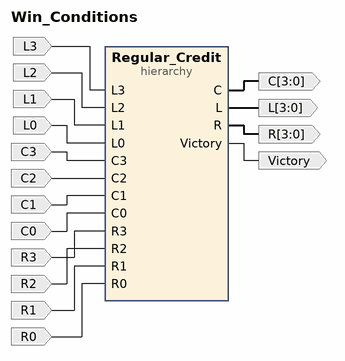
[diagram p0: block diagram of the top level]
# Vivado block design Win_Conditions, xc7a35tcpg236-1, Vivado 2018.3
create_bd_design Win_Conditions

create_bd_port -dir I L3
create_bd_port -dir I L2
create_bd_port -dir I L1
create_bd_port -dir I L0
create_bd_port -dir I C3
create_bd_port -dir I C2
create_bd_port -dir I C1
create_bd_port -dir I C0
create_bd_port -dir I R3
create_bd_port -dir I R2
create_bd_port -dir I R1
create_bd_port -dir I R0
create_bd_port -dir O Victory
create_bd_port -dir O -from 3 -to 0 L
create_bd_port -dir O -from 3 -to 0 C
create_bd_port -dir O -from 3 -to 0 R

create_bd_cell -type hier Regular_Credit

# ---- hierarchy /Regular_Credit ----
current_bd_instance /Regular_Credit
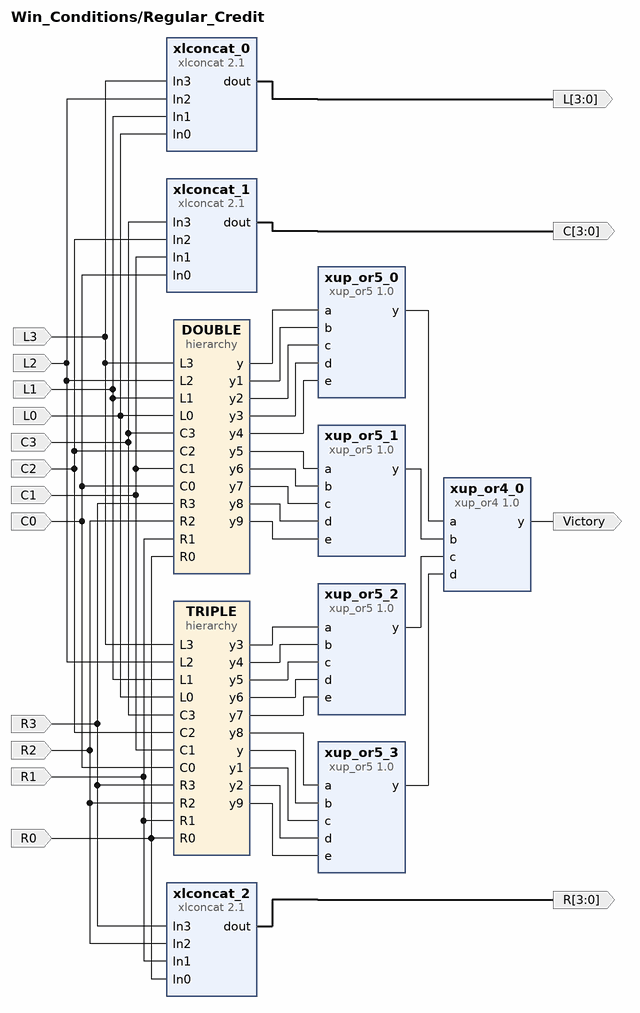
[diagram p1: block diagram inside /Regular_Credit]
create_bd_pin -dir O Victory
create_bd_pin -dir I L3
create_bd_pin -dir I L2
create_bd_pin -dir I L1
create_bd_pin -dir I L0
create_bd_pin -dir I C3
create_bd_pin -dir I C2
create_bd_pin -dir I C1
create_bd_pin -dir I C0
create_bd_pin -dir I R3
create_bd_pin -dir I R2
create_bd_pin -dir I R1
create_bd_pin -dir I R0
create_bd_pin -dir O -from 3 -to 0 L
create_bd_pin -dir O -from 3 -to 0 C
create_bd_pin -dir O -from 3 -to 0 R

create_bd_cell -type ip -vlnv xilinx.com:xup:xup_or5:1.0 xup_or5_0
set_property -dict {CONFIG.DELAY 0} [get_bd_cells xup_or5_0]
create_bd_cell -type ip -vlnv xilinx.com:xup:xup_or5:1.0 xup_or5_1
set_property -dict {CONFIG.DELAY 0} [get_bd_cells xup_or5_1]
create_bd_cell -type ip -vlnv xilinx.com:xup:xup_or5:1.0 xup_or5_2
set_property -dict {CONFIG.DELAY 0} [get_bd_cells xup_or5_2]
create_bd_cell -type ip -vlnv xilinx.com:xup:xup_or5:1.0 xup_or5_3
set_property -dict {CONFIG.DELAY 0} [get_bd_cells xup_or5_3]
create_bd_cell -type ip -vlnv xilinx.com:xup:xup_or4:1.0 xup_or4_0
set_property -dict {CONFIG.DELAY 0} [get_bd_cells xup_or4_0]
create_bd_cell -type ip -vlnv xilinx.com:ip:xlconcat:2.1 xlconcat_0
set_property -dict {CONFIG.NUM_PORTS 4} [get_bd_cells xlconcat_0]
create_bd_cell -type ip -vlnv xilinx.com:ip:xlconcat:2.1 xlconcat_1
set_property -dict {CONFIG.NUM_PORTS 4} [get_bd_cells xlconcat_1]
create_bd_cell -type ip -vlnv xilinx.com:ip:xlconcat:2.1 xlconcat_2
set_property -dict {CONFIG.NUM_PORTS 4} [get_bd_cells xlconcat_2]
create_bd_cell -type hier DOUBLE
create_bd_cell -type hier TRIPLE

# ---- hierarchy /Regular_Credit/DOUBLE ----
current_bd_instance /Regular_Credit/DOUBLE
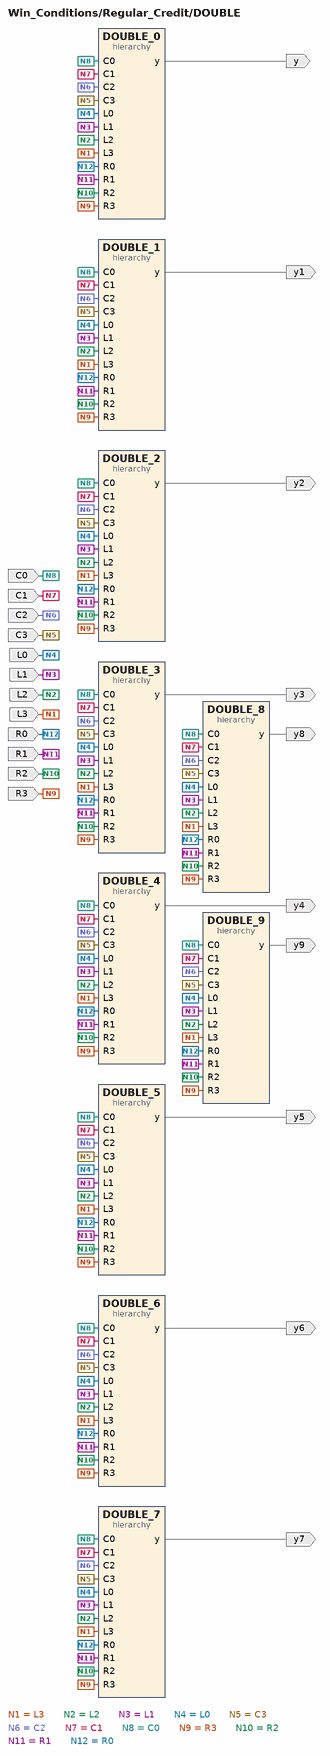
[diagram p2: block diagram inside /Regular_Credit/DOUBLE]
create_bd_pin -dir I L3
create_bd_pin -dir I L2
create_bd_pin -dir I L1
create_bd_pin -dir I L0
create_bd_pin -dir I C3
create_bd_pin -dir I C2
create_bd_pin -dir I C1
create_bd_pin -dir I C0
create_bd_pin -dir I R3
create_bd_pin -dir I R2
create_bd_pin -dir I R1
create_bd_pin -dir I R0
create_bd_pin -dir O y
create_bd_pin -dir O y1
create_bd_pin -dir O y2
create_bd_pin -dir O y3
create_bd_pin -dir O y4
create_bd_pin -dir O y5
create_bd_pin -dir O y6
create_bd_pin -dir O y7
create_bd_pin -dir O y8
create_bd_pin -dir O y9

create_bd_cell -type hier DOUBLE_0
create_bd_cell -type hier DOUBLE_1
create_bd_cell -type hier DOUBLE_2
create_bd_cell -type hier DOUBLE_3
create_bd_cell -type hier DOUBLE_4
create_bd_cell -type hier DOUBLE_5
create_bd_cell -type hier DOUBLE_6
create_bd_cell -type hier DOUBLE_7
create_bd_cell -type hier DOUBLE_8
create_bd_cell -type hier DOUBLE_9

# ---- hierarchy /Regular_Credit/DOUBLE/DOUBLE_0 ----
current_bd_instance /Regular_Credit/DOUBLE/DOUBLE_0
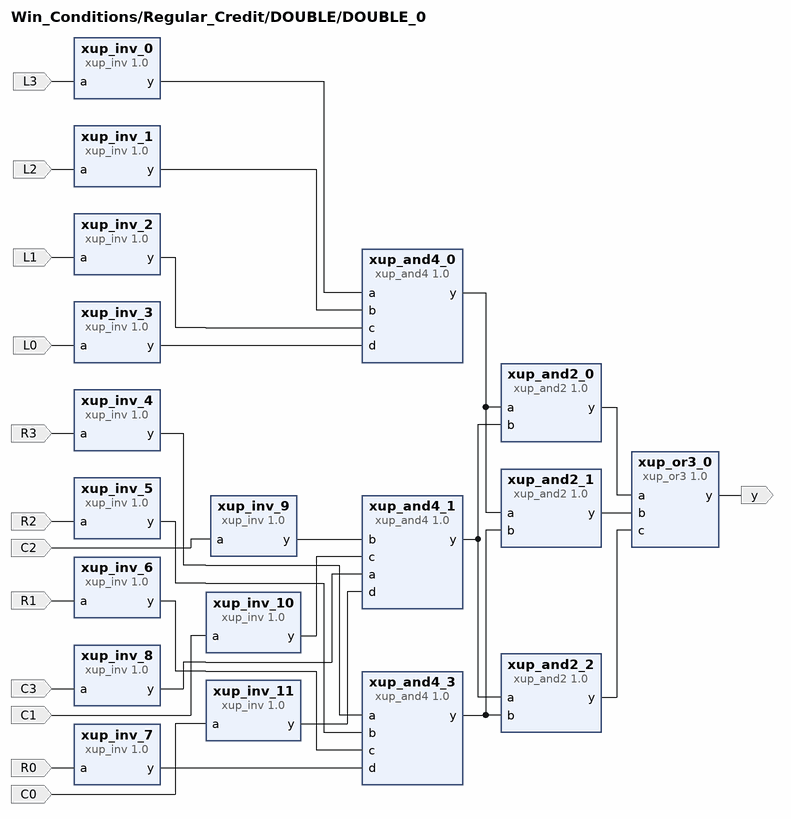
[diagram p3: block diagram inside /Regular_Credit/DOUBLE/DOUBLE_0]
create_bd_pin -dir I L3
create_bd_pin -dir I L2
create_bd_pin -dir I L1
create_bd_pin -dir I L0
create_bd_pin -dir I C3
create_bd_pin -dir I C2
create_bd_pin -dir I C1
create_bd_pin -dir I C0
create_bd_pin -dir I R3
create_bd_pin -dir I R2
create_bd_pin -dir I R1
create_bd_pin -dir I R0
create_bd_pin -dir O y

create_bd_cell -type ip -vlnv xilinx.com:xup:xup_and4:1.0 xup_and4_0
set_property -dict {CONFIG.DELAY 0} [get_bd_cells xup_and4_0]
create_bd_cell -type ip -vlnv xilinx.com:xup:xup_or3:1.0 xup_or3_0
set_property -dict {CONFIG.DELAY 0} [get_bd_cells xup_or3_0]
create_bd_cell -type ip -vlnv xilinx.com:xup:xup_and4:1.0 xup_and4_1
set_property -dict {CONFIG.DELAY 0} [get_bd_cells xup_and4_1]
create_bd_cell -type ip -vlnv xilinx.com:xup:xup_and4:1.0 xup_and4_3
set_property -dict {CONFIG.DELAY 0} [get_bd_cells xup_and4_3]
create_bd_cell -type ip -vlnv xilinx.com:xup:xup_and2:1.0 xup_and2_0
set_property -dict {CONFIG.DELAY 0} [get_bd_cells xup_and2_0]
create_bd_cell -type ip -vlnv xilinx.com:xup:xup_and2:1.0 xup_and2_1
set_property -dict {CONFIG.DELAY 0} [get_bd_cells xup_and2_1]
create_bd_cell -type ip -vlnv xilinx.com:xup:xup_and2:1.0 xup_and2_2
set_property -dict {CONFIG.DELAY 0} [get_bd_cells xup_and2_2]
create_bd_cell -type ip -vlnv xilinx.com:xup:xup_inv:1.0 xup_inv_0
set_property -dict {CONFIG.DELAY 0} [get_bd_cells xup_inv_0]
create_bd_cell -type ip -vlnv xilinx.com:xup:xup_inv:1.0 xup_inv_5
set_property -dict {CONFIG.DELAY 0} [get_bd_cells xup_inv_5]
create_bd_cell -type ip -vlnv xilinx.com:xup:xup_inv:1.0 xup_inv_3
set_property -dict {CONFIG.DELAY 0} [get_bd_cells xup_inv_3]
create_bd_cell -type ip -vlnv xilinx.com:xup:xup_inv:1.0 xup_inv_7
set_property -dict {CONFIG.DELAY 0} [get_bd_cells xup_inv_7]
create_bd_cell -type ip -vlnv xilinx.com:xup:xup_inv:1.0 xup_inv_4
set_property -dict {CONFIG.DELAY 0} [get_bd_cells xup_inv_4]
create_bd_cell -type ip -vlnv xilinx.com:xup:xup_inv:1.0 xup_inv_6
set_property -dict {CONFIG.DELAY 0} [get_bd_cells xup_inv_6]
create_bd_cell -type ip -vlnv xilinx.com:xup:xup_inv:1.0 xup_inv_1
set_property -dict {CONFIG.DELAY 0} [get_bd_cells xup_inv_1]
create_bd_cell -type ip -vlnv xilinx.com:xup:xup_inv:1.0 xup_inv_2
set_property -dict {CONFIG.DELAY 0} [get_bd_cells xup_inv_2]
create_bd_cell -type ip -vlnv xilinx.com:xup:xup_inv:1.0 xup_inv_8
set_property -dict {CONFIG.DELAY 0} [get_bd_cells xup_inv_8]
create_bd_cell -type ip -vlnv xilinx.com:xup:xup_inv:1.0 xup_inv_10
set_property -dict {CONFIG.DELAY 0} [get_bd_cells xup_inv_10]
create_bd_cell -type ip -vlnv xilinx.com:xup:xup_inv:1.0 xup_inv_9
set_property -dict {CONFIG.DELAY 0} [get_bd_cells xup_inv_9]
create_bd_cell -type ip -vlnv xilinx.com:xup:xup_inv:1.0 xup_inv_11
set_property -dict {CONFIG.DELAY 0} [get_bd_cells xup_inv_11]

# ---- hierarchy /Regular_Credit/DOUBLE/DOUBLE_1 ----
current_bd_instance /Regular_Credit/DOUBLE/DOUBLE_1
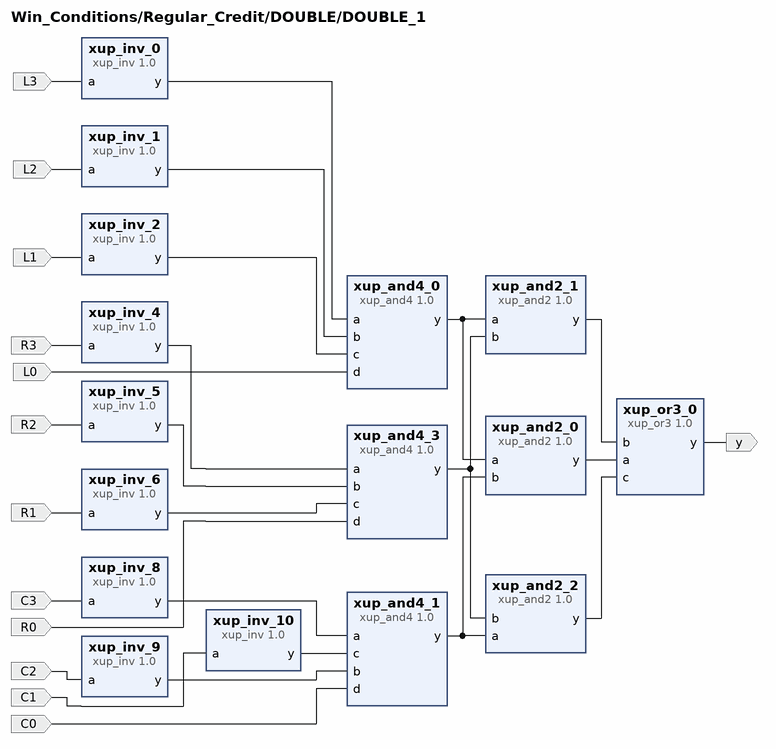
[diagram p4: block diagram inside /Regular_Credit/DOUBLE/DOUBLE_1]
create_bd_pin -dir I L3
create_bd_pin -dir I L2
create_bd_pin -dir I L1
create_bd_pin -dir I L0
create_bd_pin -dir I C3
create_bd_pin -dir I C2
create_bd_pin -dir I C1
create_bd_pin -dir I C0
create_bd_pin -dir I R3
create_bd_pin -dir I R2
create_bd_pin -dir I R1
create_bd_pin -dir I R0
create_bd_pin -dir O y

create_bd_cell -type ip -vlnv xilinx.com:xup:xup_and4:1.0 xup_and4_0
set_property -dict {CONFIG.DELAY 0} [get_bd_cells xup_and4_0]
create_bd_cell -type ip -vlnv xilinx.com:xup:xup_or3:1.0 xup_or3_0
set_property -dict {CONFIG.DELAY 0} [get_bd_cells xup_or3_0]
create_bd_cell -type ip -vlnv xilinx.com:xup:xup_and4:1.0 xup_and4_1
set_property -dict {CONFIG.DELAY 0} [get_bd_cells xup_and4_1]
create_bd_cell -type ip -vlnv xilinx.com:xup:xup_and4:1.0 xup_and4_3
set_property -dict {CONFIG.DELAY 0} [get_bd_cells xup_and4_3]
create_bd_cell -type ip -vlnv xilinx.com:xup:xup_and2:1.0 xup_and2_0
set_property -dict {CONFIG.DELAY 0} [get_bd_cells xup_and2_0]
create_bd_cell -type ip -vlnv xilinx.com:xup:xup_and2:1.0 xup_and2_1
set_property -dict {CONFIG.DELAY 0} [get_bd_cells xup_and2_1]
create_bd_cell -type ip -vlnv xilinx.com:xup:xup_and2:1.0 xup_and2_2
set_property -dict {CONFIG.DELAY 0} [get_bd_cells xup_and2_2]
create_bd_cell -type ip -vlnv xilinx.com:xup:xup_inv:1.0 xup_inv_0
set_property -dict {CONFIG.DELAY 0} [get_bd_cells xup_inv_0]
create_bd_cell -type ip -vlnv xilinx.com:xup:xup_inv:1.0 xup_inv_5
set_property -dict {CONFIG.DELAY 0} [get_bd_cells xup_inv_5]
create_bd_cell -type ip -vlnv xilinx.com:xup:xup_inv:1.0 xup_inv_4
set_property -dict {CONFIG.DELAY 0} [get_bd_cells xup_inv_4]
create_bd_cell -type ip -vlnv xilinx.com:xup:xup_inv:1.0 xup_inv_6
set_property -dict {CONFIG.DELAY 0} [get_bd_cells xup_inv_6]
create_bd_cell -type ip -vlnv xilinx.com:xup:xup_inv:1.0 xup_inv_1
set_property -dict {CONFIG.DELAY 0} [get_bd_cells xup_inv_1]
create_bd_cell -type ip -vlnv xilinx.com:xup:xup_inv:1.0 xup_inv_2
set_property -dict {CONFIG.DELAY 0} [get_bd_cells xup_inv_2]
create_bd_cell -type ip -vlnv xilinx.com:xup:xup_inv:1.0 xup_inv_8
set_property -dict {CONFIG.DELAY 0} [get_bd_cells xup_inv_8]
create_bd_cell -type ip -vlnv xilinx.com:xup:xup_inv:1.0 xup_inv_10
set_property -dict {CONFIG.DELAY 0} [get_bd_cells xup_inv_10]
create_bd_cell -type ip -vlnv xilinx.com:xup:xup_inv:1.0 xup_inv_9
set_property -dict {CONFIG.DELAY 0} [get_bd_cells xup_inv_9]

# ---- hierarchy /Regular_Credit/DOUBLE/DOUBLE_2 ----
current_bd_instance /Regular_Credit/DOUBLE/DOUBLE_2
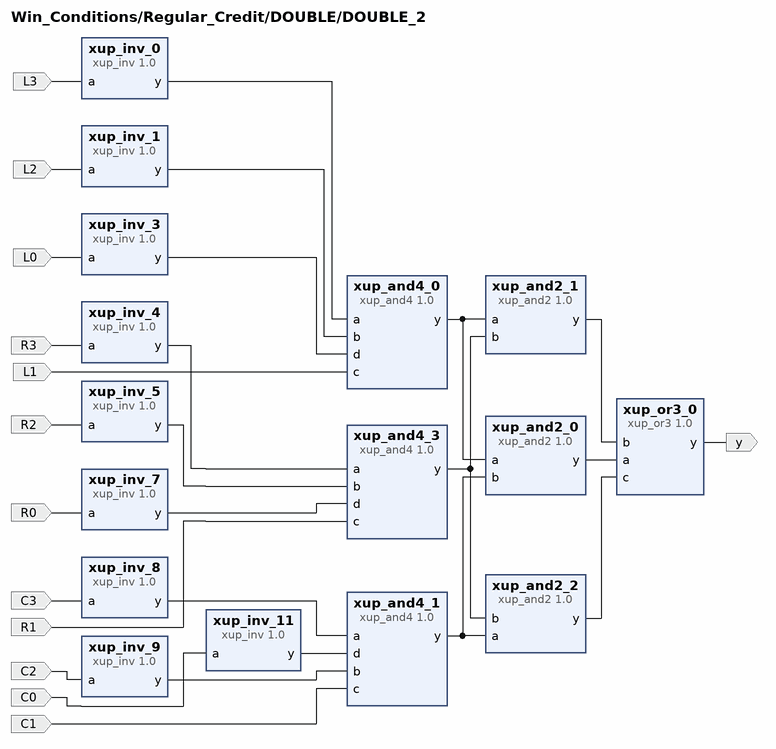
[diagram p5: block diagram inside /Regular_Credit/DOUBLE/DOUBLE_2]
create_bd_pin -dir I L3
create_bd_pin -dir I L2
create_bd_pin -dir I L1
create_bd_pin -dir I L0
create_bd_pin -dir I C3
create_bd_pin -dir I C2
create_bd_pin -dir I C1
create_bd_pin -dir I C0
create_bd_pin -dir I R3
create_bd_pin -dir I R2
create_bd_pin -dir I R1
create_bd_pin -dir I R0
create_bd_pin -dir O y

create_bd_cell -type ip -vlnv xilinx.com:xup:xup_and4:1.0 xup_and4_0
set_property -dict {CONFIG.DELAY 0} [get_bd_cells xup_and4_0]
create_bd_cell -type ip -vlnv xilinx.com:xup:xup_or3:1.0 xup_or3_0
set_property -dict {CONFIG.DELAY 0} [get_bd_cells xup_or3_0]
create_bd_cell -type ip -vlnv xilinx.com:xup:xup_and4:1.0 xup_and4_1
set_property -dict {CONFIG.DELAY 0} [get_bd_cells xup_and4_1]
create_bd_cell -type ip -vlnv xilinx.com:xup:xup_and4:1.0 xup_and4_3
set_property -dict {CONFIG.DELAY 0} [get_bd_cells xup_and4_3]
create_bd_cell -type ip -vlnv xilinx.com:xup:xup_and2:1.0 xup_and2_0
set_property -dict {CONFIG.DELAY 0} [get_bd_cells xup_and2_0]
create_bd_cell -type ip -vlnv xilinx.com:xup:xup_and2:1.0 xup_and2_1
set_property -dict {CONFIG.DELAY 0} [get_bd_cells xup_and2_1]
create_bd_cell -type ip -vlnv xilinx.com:xup:xup_and2:1.0 xup_and2_2
set_property -dict {CONFIG.DELAY 0} [get_bd_cells xup_and2_2]
create_bd_cell -type ip -vlnv xilinx.com:xup:xup_inv:1.0 xup_inv_0
set_property -dict {CONFIG.DELAY 0} [get_bd_cells xup_inv_0]
create_bd_cell -type ip -vlnv xilinx.com:xup:xup_inv:1.0 xup_inv_5
set_property -dict {CONFIG.DELAY 0} [get_bd_cells xup_inv_5]
create_bd_cell -type ip -vlnv xilinx.com:xup:xup_inv:1.0 xup_inv_3
set_property -dict {CONFIG.DELAY 0} [get_bd_cells xup_inv_3]
create_bd_cell -type ip -vlnv xilinx.com:xup:xup_inv:1.0 xup_inv_7
set_property -dict {CONFIG.DELAY 0} [get_bd_cells xup_inv_7]
create_bd_cell -type ip -vlnv xilinx.com:xup:xup_inv:1.0 xup_inv_4
set_property -dict {CONFIG.DELAY 0} [get_bd_cells xup_inv_4]
create_bd_cell -type ip -vlnv xilinx.com:xup:xup_inv:1.0 xup_inv_1
set_property -dict {CONFIG.DELAY 0} [get_bd_cells xup_inv_1]
create_bd_cell -type ip -vlnv xilinx.com:xup:xup_inv:1.0 xup_inv_8
set_property -dict {CONFIG.DELAY 0} [get_bd_cells xup_inv_8]
create_bd_cell -type ip -vlnv xilinx.com:xup:xup_inv:1.0 xup_inv_9
set_property -dict {CONFIG.DELAY 0} [get_bd_cells xup_inv_9]
create_bd_cell -type ip -vlnv xilinx.com:xup:xup_inv:1.0 xup_inv_11
set_property -dict {CONFIG.DELAY 0} [get_bd_cells xup_inv_11]

# ---- hierarchy /Regular_Credit/DOUBLE/DOUBLE_3 ----
current_bd_instance /Regular_Credit/DOUBLE/DOUBLE_3
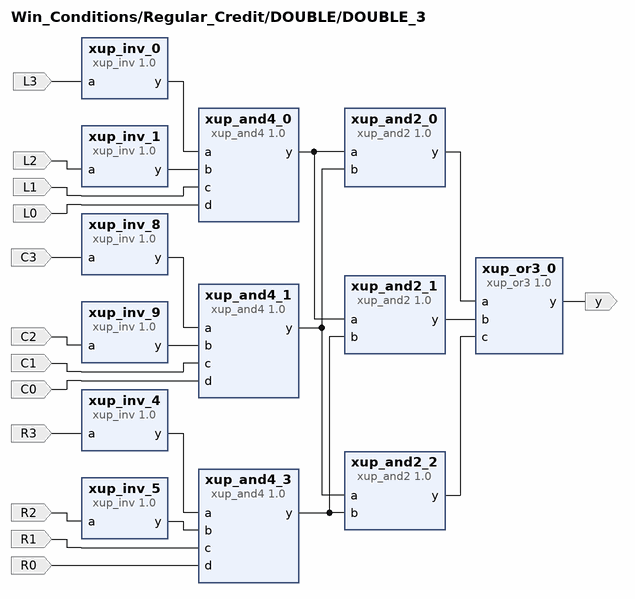
[diagram p6: block diagram inside /Regular_Credit/DOUBLE/DOUBLE_3]
create_bd_pin -dir I L3
create_bd_pin -dir I L2
create_bd_pin -dir I L1
create_bd_pin -dir I L0
create_bd_pin -dir I C3
create_bd_pin -dir I C2
create_bd_pin -dir I C1
create_bd_pin -dir I C0
create_bd_pin -dir I R3
create_bd_pin -dir I R2
create_bd_pin -dir I R1
create_bd_pin -dir I R0
create_bd_pin -dir O y

create_bd_cell -type ip -vlnv xilinx.com:xup:xup_and4:1.0 xup_and4_0
set_property -dict {CONFIG.DELAY 0} [get_bd_cells xup_and4_0]
create_bd_cell -type ip -vlnv xilinx.com:xup:xup_or3:1.0 xup_or3_0
set_property -dict {CONFIG.DELAY 0} [get_bd_cells xup_or3_0]
create_bd_cell -type ip -vlnv xilinx.com:xup:xup_and4:1.0 xup_and4_1
set_property -dict {CONFIG.DELAY 0} [get_bd_cells xup_and4_1]
create_bd_cell -type ip -vlnv xilinx.com:xup:xup_and4:1.0 xup_and4_3
set_property -dict {CONFIG.DELAY 0} [get_bd_cells xup_and4_3]
create_bd_cell -type ip -vlnv xilinx.com:xup:xup_and2:1.0 xup_and2_0
set_property -dict {CONFIG.DELAY 0} [get_bd_cells xup_and2_0]
create_bd_cell -type ip -vlnv xilinx.com:xup:xup_and2:1.0 xup_and2_1
set_property -dict {CONFIG.DELAY 0} [get_bd_cells xup_and2_1]
create_bd_cell -type ip -vlnv xilinx.com:xup:xup_and2:1.0 xup_and2_2
set_property -dict {CONFIG.DELAY 0} [get_bd_cells xup_and2_2]
create_bd_cell -type ip -vlnv xilinx.com:xup:xup_inv:1.0 xup_inv_0
set_property -dict {CONFIG.DELAY 0} [get_bd_cells xup_inv_0]
create_bd_cell -type ip -vlnv xilinx.com:xup:xup_inv:1.0 xup_inv_5
set_property -dict {CONFIG.DELAY 0} [get_bd_cells xup_inv_5]
create_bd_cell -type ip -vlnv xilinx.com:xup:xup_inv:1.0 xup_inv_4
set_property -dict {CONFIG.DELAY 0} [get_bd_cells xup_inv_4]
create_bd_cell -type ip -vlnv xilinx.com:xup:xup_inv:1.0 xup_inv_1
set_property -dict {CONFIG.DELAY 0} [get_bd_cells xup_inv_1]
create_bd_cell -type ip -vlnv xilinx.com:xup:xup_inv:1.0 xup_inv_8
set_property -dict {CONFIG.DELAY 0} [get_bd_cells xup_inv_8]
create_bd_cell -type ip -vlnv xilinx.com:xup:xup_inv:1.0 xup_inv_9
set_property -dict {CONFIG.DELAY 0} [get_bd_cells xup_inv_9]

# ---- hierarchy /Regular_Credit/DOUBLE/DOUBLE_4 ----
current_bd_instance /Regular_Credit/DOUBLE/DOUBLE_4
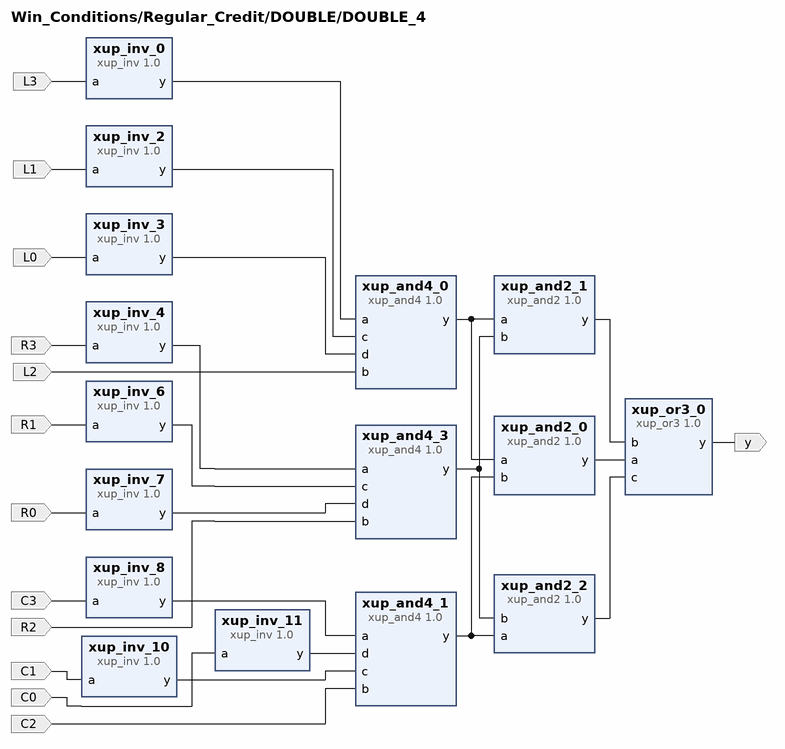
[diagram p7: block diagram inside /Regular_Credit/DOUBLE/DOUBLE_4]
create_bd_pin -dir I L3
create_bd_pin -dir I L2
create_bd_pin -dir I L1
create_bd_pin -dir I L0
create_bd_pin -dir I C3
create_bd_pin -dir I C2
create_bd_pin -dir I C1
create_bd_pin -dir I C0
create_bd_pin -dir I R3
create_bd_pin -dir I R2
create_bd_pin -dir I R1
create_bd_pin -dir I R0
create_bd_pin -dir O y

create_bd_cell -type ip -vlnv xilinx.com:xup:xup_and4:1.0 xup_and4_0
set_property -dict {CONFIG.DELAY 0} [get_bd_cells xup_and4_0]
create_bd_cell -type ip -vlnv xilinx.com:xup:xup_or3:1.0 xup_or3_0
set_property -dict {CONFIG.DELAY 0} [get_bd_cells xup_or3_0]
create_bd_cell -type ip -vlnv xilinx.com:xup:xup_and4:1.0 xup_and4_1
set_property -dict {CONFIG.DELAY 0} [get_bd_cells xup_and4_1]
create_bd_cell -type ip -vlnv xilinx.com:xup:xup_and4:1.0 xup_and4_3
set_property -dict {CONFIG.DELAY 0} [get_bd_cells xup_and4_3]
create_bd_cell -type ip -vlnv xilinx.com:xup:xup_and2:1.0 xup_and2_0
set_property -dict {CONFIG.DELAY 0} [get_bd_cells xup_and2_0]
create_bd_cell -type ip -vlnv xilinx.com:xup:xup_and2:1.0 xup_and2_1
set_property -dict {CONFIG.DELAY 0} [get_bd_cells xup_and2_1]
create_bd_cell -type ip -vlnv xilinx.com:xup:xup_and2:1.0 xup_and2_2
set_property -dict {CONFIG.DELAY 0} [get_bd_cells xup_and2_2]
create_bd_cell -type ip -vlnv xilinx.com:xup:xup_inv:1.0 xup_inv_0
set_property -dict {CONFIG.DELAY 0} [get_bd_cells xup_inv_0]
create_bd_cell -type ip -vlnv xilinx.com:xup:xup_inv:1.0 xup_inv_3
set_property -dict {CONFIG.DELAY 0} [get_bd_cells xup_inv_3]
create_bd_cell -type ip -vlnv xilinx.com:xup:xup_inv:1.0 xup_inv_7
set_property -dict {CONFIG.DELAY 0} [get_bd_cells xup_inv_7]
create_bd_cell -type ip -vlnv xilinx.com:xup:xup_inv:1.0 xup_inv_4
set_property -dict {CONFIG.DELAY 0} [get_bd_cells xup_inv_4]
create_bd_cell -type ip -vlnv xilinx.com:xup:xup_inv:1.0 xup_inv_6
set_property -dict {CONFIG.DELAY 0} [get_bd_cells xup_inv_6]
create_bd_cell -type ip -vlnv xilinx.com:xup:xup_inv:1.0 xup_inv_2
set_property -dict {CONFIG.DELAY 0} [get_bd_cells xup_inv_2]
create_bd_cell -type ip -vlnv xilinx.com:xup:xup_inv:1.0 xup_inv_8
set_property -dict {CONFIG.DELAY 0} [get_bd_cells xup_inv_8]
create_bd_cell -type ip -vlnv xilinx.com:xup:xup_inv:1.0 xup_inv_10
set_property -dict {CONFIG.DELAY 0} [get_bd_cells xup_inv_10]
create_bd_cell -type ip -vlnv xilinx.com:xup:xup_inv:1.0 xup_inv_11
set_property -dict {CONFIG.DELAY 0} [get_bd_cells xup_inv_11]

# ---- hierarchy /Regular_Credit/DOUBLE/DOUBLE_5 ----
current_bd_instance /Regular_Credit/DOUBLE/DOUBLE_5
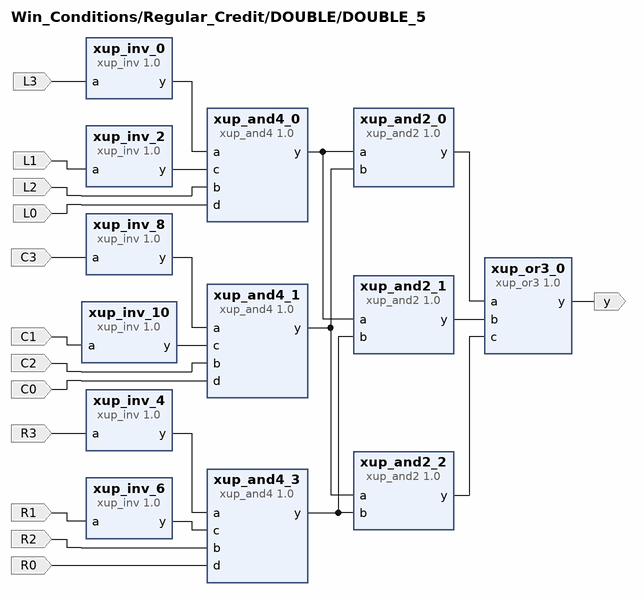
[diagram p8: block diagram inside /Regular_Credit/DOUBLE/DOUBLE_5]
create_bd_pin -dir I L3
create_bd_pin -dir I L2
create_bd_pin -dir I L1
create_bd_pin -dir I L0
create_bd_pin -dir I C3
create_bd_pin -dir I C2
create_bd_pin -dir I C1
create_bd_pin -dir I C0
create_bd_pin -dir I R3
create_bd_pin -dir I R2
create_bd_pin -dir I R1
create_bd_pin -dir I R0
create_bd_pin -dir O y

create_bd_cell -type ip -vlnv xilinx.com:xup:xup_and4:1.0 xup_and4_0
set_property -dict {CONFIG.DELAY 0} [get_bd_cells xup_and4_0]
create_bd_cell -type ip -vlnv xilinx.com:xup:xup_or3:1.0 xup_or3_0
set_property -dict {CONFIG.DELAY 0} [get_bd_cells xup_or3_0]
create_bd_cell -type ip -vlnv xilinx.com:xup:xup_and4:1.0 xup_and4_1
set_property -dict {CONFIG.DELAY 0} [get_bd_cells xup_and4_1]
create_bd_cell -type ip -vlnv xilinx.com:xup:xup_and4:1.0 xup_and4_3
set_property -dict {CONFIG.DELAY 0} [get_bd_cells xup_and4_3]
create_bd_cell -type ip -vlnv xilinx.com:xup:xup_and2:1.0 xup_and2_0
set_property -dict {CONFIG.DELAY 0} [get_bd_cells xup_and2_0]
create_bd_cell -type ip -vlnv xilinx.com:xup:xup_and2:1.0 xup_and2_1
set_property -dict {CONFIG.DELAY 0} [get_bd_cells xup_and2_1]
create_bd_cell -type ip -vlnv xilinx.com:xup:xup_and2:1.0 xup_and2_2
set_property -dict {CONFIG.DELAY 0} [get_bd_cells xup_and2_2]
create_bd_cell -type ip -vlnv xilinx.com:xup:xup_inv:1.0 xup_inv_0
set_property -dict {CONFIG.DELAY 0} [get_bd_cells xup_inv_0]
create_bd_cell -type ip -vlnv xilinx.com:xup:xup_inv:1.0 xup_inv_4
set_property -dict {CONFIG.DELAY 0} [get_bd_cells xup_inv_4]
create_bd_cell -type ip -vlnv xilinx.com:xup:xup_inv:1.0 xup_inv_6
set_property -dict {CONFIG.DELAY 0} [get_bd_cells xup_inv_6]
create_bd_cell -type ip -vlnv xilinx.com:xup:xup_inv:1.0 xup_inv_2
set_property -dict {CONFIG.DELAY 0} [get_bd_cells xup_inv_2]
create_bd_cell -type ip -vlnv xilinx.com:xup:xup_inv:1.0 xup_inv_8
set_property -dict {CONFIG.DELAY 0} [get_bd_cells xup_inv_8]
create_bd_cell -type ip -vlnv xilinx.com:xup:xup_inv:1.0 xup_inv_10
set_property -dict {CONFIG.DELAY 0} [get_bd_cells xup_inv_10]

# ---- hierarchy /Regular_Credit/DOUBLE/DOUBLE_6 ----
current_bd_instance /Regular_Credit/DOUBLE/DOUBLE_6
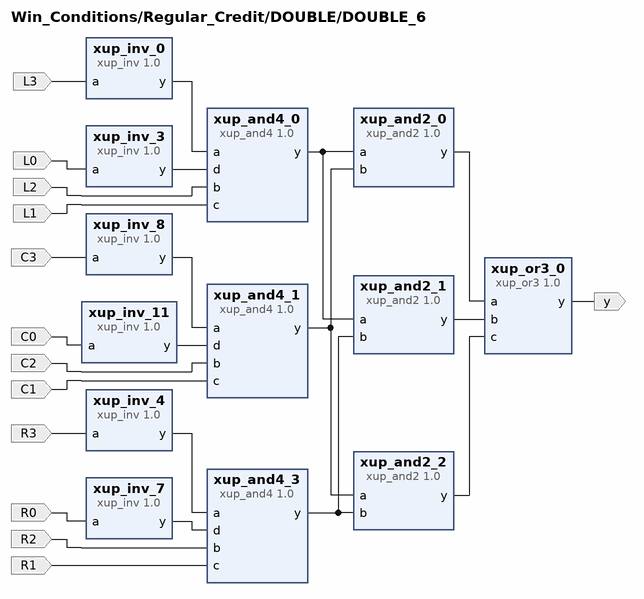
[diagram p9: block diagram inside /Regular_Credit/DOUBLE/DOUBLE_6]
create_bd_pin -dir I L3
create_bd_pin -dir I L2
create_bd_pin -dir I L1
create_bd_pin -dir I L0
create_bd_pin -dir I C3
create_bd_pin -dir I C2
create_bd_pin -dir I C1
create_bd_pin -dir I C0
create_bd_pin -dir I R3
create_bd_pin -dir I R2
create_bd_pin -dir I R1
create_bd_pin -dir I R0
create_bd_pin -dir O y

create_bd_cell -type ip -vlnv xilinx.com:xup:xup_and4:1.0 xup_and4_0
set_property -dict {CONFIG.DELAY 0} [get_bd_cells xup_and4_0]
create_bd_cell -type ip -vlnv xilinx.com:xup:xup_or3:1.0 xup_or3_0
set_property -dict {CONFIG.DELAY 0} [get_bd_cells xup_or3_0]
create_bd_cell -type ip -vlnv xilinx.com:xup:xup_and4:1.0 xup_and4_1
set_property -dict {CONFIG.DELAY 0} [get_bd_cells xup_and4_1]
create_bd_cell -type ip -vlnv xilinx.com:xup:xup_and4:1.0 xup_and4_3
set_property -dict {CONFIG.DELAY 0} [get_bd_cells xup_and4_3]
create_bd_cell -type ip -vlnv xilinx.com:xup:xup_and2:1.0 xup_and2_0
set_property -dict {CONFIG.DELAY 0} [get_bd_cells xup_and2_0]
create_bd_cell -type ip -vlnv xilinx.com:xup:xup_and2:1.0 xup_and2_1
set_property -dict {CONFIG.DELAY 0} [get_bd_cells xup_and2_1]
create_bd_cell -type ip -vlnv xilinx.com:xup:xup_and2:1.0 xup_and2_2
set_property -dict {CONFIG.DELAY 0} [get_bd_cells xup_and2_2]
create_bd_cell -type ip -vlnv xilinx.com:xup:xup_inv:1.0 xup_inv_0
set_property -dict {CONFIG.DELAY 0} [get_bd_cells xup_inv_0]
create_bd_cell -type ip -vlnv xilinx.com:xup:xup_inv:1.0 xup_inv_3
set_property -dict {CONFIG.DELAY 0} [get_bd_cells xup_inv_3]
create_bd_cell -type ip -vlnv xilinx.com:xup:xup_inv:1.0 xup_inv_7
set_property -dict {CONFIG.DELAY 0} [get_bd_cells xup_inv_7]
create_bd_cell -type ip -vlnv xilinx.com:xup:xup_inv:1.0 xup_inv_4
set_property -dict {CONFIG.DELAY 0} [get_bd_cells xup_inv_4]
create_bd_cell -type ip -vlnv xilinx.com:xup:xup_inv:1.0 xup_inv_8
set_property -dict {CONFIG.DELAY 0} [get_bd_cells xup_inv_8]
create_bd_cell -type ip -vlnv xilinx.com:xup:xup_inv:1.0 xup_inv_11
set_property -dict {CONFIG.DELAY 0} [get_bd_cells xup_inv_11]

# ---- hierarchy /Regular_Credit/DOUBLE/DOUBLE_7 ----
current_bd_instance /Regular_Credit/DOUBLE/DOUBLE_7
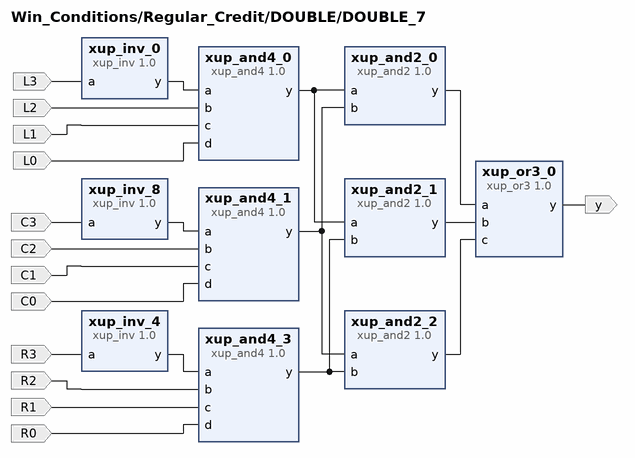
[diagram p10: block diagram inside /Regular_Credit/DOUBLE/DOUBLE_7]
create_bd_pin -dir I L3
create_bd_pin -dir I L2
create_bd_pin -dir I L1
create_bd_pin -dir I L0
create_bd_pin -dir I C3
create_bd_pin -dir I C2
create_bd_pin -dir I C1
create_bd_pin -dir I C0
create_bd_pin -dir I R3
create_bd_pin -dir I R2
create_bd_pin -dir I R1
create_bd_pin -dir I R0
create_bd_pin -dir O y

create_bd_cell -type ip -vlnv xilinx.com:xup:xup_and4:1.0 xup_and4_0
set_property -dict {CONFIG.DELAY 0} [get_bd_cells xup_and4_0]
create_bd_cell -type ip -vlnv xilinx.com:xup:xup_or3:1.0 xup_or3_0
set_property -dict {CONFIG.DELAY 0} [get_bd_cells xup_or3_0]
create_bd_cell -type ip -vlnv xilinx.com:xup:xup_and4:1.0 xup_and4_1
set_property -dict {CONFIG.DELAY 0} [get_bd_cells xup_and4_1]
create_bd_cell -type ip -vlnv xilinx.com:xup:xup_and4:1.0 xup_and4_3
set_property -dict {CONFIG.DELAY 0} [get_bd_cells xup_and4_3]
create_bd_cell -type ip -vlnv xilinx.com:xup:xup_and2:1.0 xup_and2_0
set_property -dict {CONFIG.DELAY 0} [get_bd_cells xup_and2_0]
create_bd_cell -type ip -vlnv xilinx.com:xup:xup_and2:1.0 xup_and2_1
set_property -dict {CONFIG.DELAY 0} [get_bd_cells xup_and2_1]
create_bd_cell -type ip -vlnv xilinx.com:xup:xup_and2:1.0 xup_and2_2
set_property -dict {CONFIG.DELAY 0} [get_bd_cells xup_and2_2]
create_bd_cell -type ip -vlnv xilinx.com:xup:xup_inv:1.0 xup_inv_0
set_property -dict {CONFIG.DELAY 0} [get_bd_cells xup_inv_0]
create_bd_cell -type ip -vlnv xilinx.com:xup:xup_inv:1.0 xup_inv_4
set_property -dict {CONFIG.DELAY 0} [get_bd_cells xup_inv_4]
create_bd_cell -type ip -vlnv xilinx.com:xup:xup_inv:1.0 xup_inv_8
set_property -dict {CONFIG.DELAY 0} [get_bd_cells xup_inv_8]

# ---- hierarchy /Regular_Credit/DOUBLE/DOUBLE_8 ----
current_bd_instance /Regular_Credit/DOUBLE/DOUBLE_8
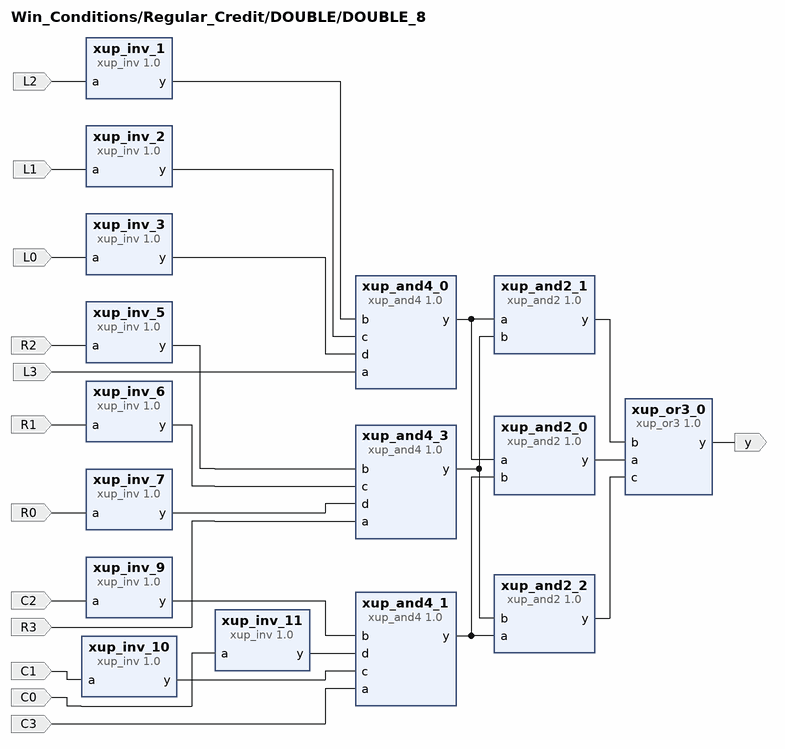
[diagram p11: block diagram inside /Regular_Credit/DOUBLE/DOUBLE_8]
create_bd_pin -dir I L3
create_bd_pin -dir I L2
create_bd_pin -dir I L1
create_bd_pin -dir I L0
create_bd_pin -dir I C3
create_bd_pin -dir I C2
create_bd_pin -dir I C1
create_bd_pin -dir I C0
create_bd_pin -dir I R3
create_bd_pin -dir I R2
create_bd_pin -dir I R1
create_bd_pin -dir I R0
create_bd_pin -dir O y

create_bd_cell -type ip -vlnv xilinx.com:xup:xup_and4:1.0 xup_and4_0
set_property -dict {CONFIG.DELAY 0} [get_bd_cells xup_and4_0]
create_bd_cell -type ip -vlnv xilinx.com:xup:xup_or3:1.0 xup_or3_0
set_property -dict {CONFIG.DELAY 0} [get_bd_cells xup_or3_0]
create_bd_cell -type ip -vlnv xilinx.com:xup:xup_and4:1.0 xup_and4_1
set_property -dict {CONFIG.DELAY 0} [get_bd_cells xup_and4_1]
create_bd_cell -type ip -vlnv xilinx.com:xup:xup_and4:1.0 xup_and4_3
set_property -dict {CONFIG.DELAY 0} [get_bd_cells xup_and4_3]
create_bd_cell -type ip -vlnv xilinx.com:xup:xup_and2:1.0 xup_and2_0
set_property -dict {CONFIG.DELAY 0} [get_bd_cells xup_and2_0]
create_bd_cell -type ip -vlnv xilinx.com:xup:xup_and2:1.0 xup_and2_1
set_property -dict {CONFIG.DELAY 0} [get_bd_cells xup_and2_1]
create_bd_cell -type ip -vlnv xilinx.com:xup:xup_and2:1.0 xup_and2_2
set_property -dict {CONFIG.DELAY 0} [get_bd_cells xup_and2_2]
create_bd_cell -type ip -vlnv xilinx.com:xup:xup_inv:1.0 xup_inv_5
set_property -dict {CONFIG.DELAY 0} [get_bd_cells xup_inv_5]
create_bd_cell -type ip -vlnv xilinx.com:xup:xup_inv:1.0 xup_inv_3
set_property -dict {CONFIG.DELAY 0} [get_bd_cells xup_inv_3]
create_bd_cell -type ip -vlnv xilinx.com:xup:xup_inv:1.0 xup_inv_7
set_property -dict {CONFIG.DELAY 0} [get_bd_cells xup_inv_7]
create_bd_cell -type ip -vlnv xilinx.com:xup:xup_inv:1.0 xup_inv_6
set_property -dict {CONFIG.DELAY 0} [get_bd_cells xup_inv_6]
create_bd_cell -type ip -vlnv xilinx.com:xup:xup_inv:1.0 xup_inv_1
set_property -dict {CONFIG.DELAY 0} [get_bd_cells xup_inv_1]
create_bd_cell -type ip -vlnv xilinx.com:xup:xup_inv:1.0 xup_inv_2
set_property -dict {CONFIG.DELAY 0} [get_bd_cells xup_inv_2]
create_bd_cell -type ip -vlnv xilinx.com:xup:xup_inv:1.0 xup_inv_10
set_property -dict {CONFIG.DELAY 0} [get_bd_cells xup_inv_10]
create_bd_cell -type ip -vlnv xilinx.com:xup:xup_inv:1.0 xup_inv_9
set_property -dict {CONFIG.DELAY 0} [get_bd_cells xup_inv_9]
create_bd_cell -type ip -vlnv xilinx.com:xup:xup_inv:1.0 xup_inv_11
set_property -dict {CONFIG.DELAY 0} [get_bd_cells xup_inv_11]

# ---- hierarchy /Regular_Credit/DOUBLE/DOUBLE_9 ----
current_bd_instance /Regular_Credit/DOUBLE/DOUBLE_9
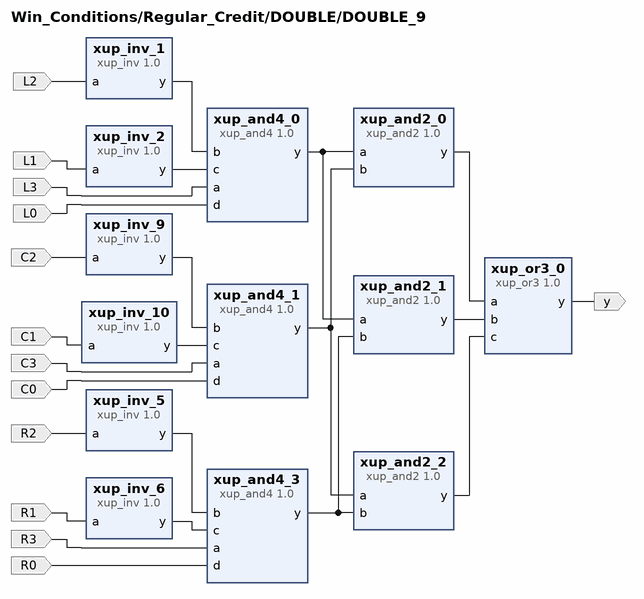
[diagram p12: block diagram inside /Regular_Credit/DOUBLE/DOUBLE_9]
create_bd_pin -dir I L3
create_bd_pin -dir I L2
create_bd_pin -dir I L1
create_bd_pin -dir I L0
create_bd_pin -dir I C3
create_bd_pin -dir I C2
create_bd_pin -dir I C1
create_bd_pin -dir I C0
create_bd_pin -dir I R3
create_bd_pin -dir I R2
create_bd_pin -dir I R1
create_bd_pin -dir I R0
create_bd_pin -dir O y

create_bd_cell -type ip -vlnv xilinx.com:xup:xup_and4:1.0 xup_and4_0
set_property -dict {CONFIG.DELAY 0} [get_bd_cells xup_and4_0]
create_bd_cell -type ip -vlnv xilinx.com:xup:xup_or3:1.0 xup_or3_0
set_property -dict {CONFIG.DELAY 0} [get_bd_cells xup_or3_0]
create_bd_cell -type ip -vlnv xilinx.com:xup:xup_and4:1.0 xup_and4_1
set_property -dict {CONFIG.DELAY 0} [get_bd_cells xup_and4_1]
create_bd_cell -type ip -vlnv xilinx.com:xup:xup_and4:1.0 xup_and4_3
set_property -dict {CONFIG.DELAY 0} [get_bd_cells xup_and4_3]
create_bd_cell -type ip -vlnv xilinx.com:xup:xup_and2:1.0 xup_and2_0
set_property -dict {CONFIG.DELAY 0} [get_bd_cells xup_and2_0]
create_bd_cell -type ip -vlnv xilinx.com:xup:xup_and2:1.0 xup_and2_1
set_property -dict {CONFIG.DELAY 0} [get_bd_cells xup_and2_1]
create_bd_cell -type ip -vlnv xilinx.com:xup:xup_and2:1.0 xup_and2_2
set_property -dict {CONFIG.DELAY 0} [get_bd_cells xup_and2_2]
create_bd_cell -type ip -vlnv xilinx.com:xup:xup_inv:1.0 xup_inv_5
set_property -dict {CONFIG.DELAY 0} [get_bd_cells xup_inv_5]
create_bd_cell -type ip -vlnv xilinx.com:xup:xup_inv:1.0 xup_inv_6
set_property -dict {CONFIG.DELAY 0} [get_bd_cells xup_inv_6]
create_bd_cell -type ip -vlnv xilinx.com:xup:xup_inv:1.0 xup_inv_1
set_property -dict {CONFIG.DELAY 0} [get_bd_cells xup_inv_1]
create_bd_cell -type ip -vlnv xilinx.com:xup:xup_inv:1.0 xup_inv_2
set_property -dict {CONFIG.DELAY 0} [get_bd_cells xup_inv_2]
create_bd_cell -type ip -vlnv xilinx.com:xup:xup_inv:1.0 xup_inv_10
set_property -dict {CONFIG.DELAY 0} [get_bd_cells xup_inv_10]
create_bd_cell -type ip -vlnv xilinx.com:xup:xup_inv:1.0 xup_inv_9
set_property -dict {CONFIG.DELAY 0} [get_bd_cells xup_inv_9]

# ---- hierarchy /Regular_Credit/TRIPLE ----
current_bd_instance /Regular_Credit/TRIPLE
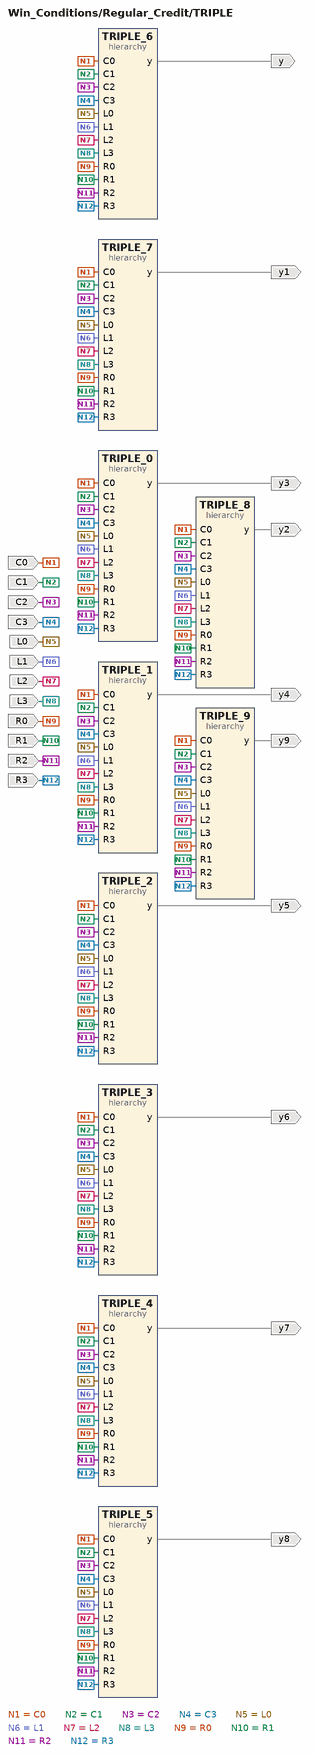
[diagram p13: block diagram inside /Regular_Credit/TRIPLE]
create_bd_pin -dir I C0
create_bd_pin -dir I C1
create_bd_pin -dir I C2
create_bd_pin -dir I C3
create_bd_pin -dir I L0
create_bd_pin -dir I L1
create_bd_pin -dir I L2
create_bd_pin -dir I L3
create_bd_pin -dir I R0
create_bd_pin -dir I R1
create_bd_pin -dir I R2
create_bd_pin -dir I R3
create_bd_pin -dir O y
create_bd_pin -dir O y1
create_bd_pin -dir O y2
create_bd_pin -dir O y3
create_bd_pin -dir O y4
create_bd_pin -dir O y5
create_bd_pin -dir O y6
create_bd_pin -dir O y7
create_bd_pin -dir O y8
create_bd_pin -dir O y9

create_bd_cell -type hier TRIPLE_6
create_bd_cell -type hier TRIPLE_7
create_bd_cell -type hier TRIPLE_8
create_bd_cell -type hier TRIPLE_0
create_bd_cell -type hier TRIPLE_1
create_bd_cell -type hier TRIPLE_2
create_bd_cell -type hier TRIPLE_3
create_bd_cell -type hier TRIPLE_4
create_bd_cell -type hier TRIPLE_5
create_bd_cell -type hier TRIPLE_9

# ---- hierarchy /Regular_Credit/TRIPLE/TRIPLE_6 ----
current_bd_instance /Regular_Credit/TRIPLE/TRIPLE_6
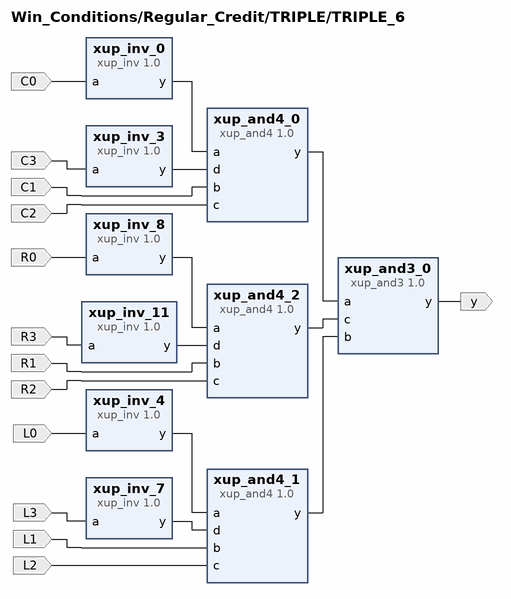
[diagram p14: block diagram inside /Regular_Credit/TRIPLE/TRIPLE_6]
create_bd_pin -dir I C0
create_bd_pin -dir I C1
create_bd_pin -dir I C2
create_bd_pin -dir I C3
create_bd_pin -dir I L0
create_bd_pin -dir I L1
create_bd_pin -dir I L2
create_bd_pin -dir I L3
create_bd_pin -dir I R0
create_bd_pin -dir I R1
create_bd_pin -dir I R2
create_bd_pin -dir I R3
create_bd_pin -dir O y

create_bd_cell -type ip -vlnv xilinx.com:xup:xup_and4:1.0 xup_and4_0
set_property -dict {CONFIG.DELAY 0} [get_bd_cells xup_and4_0]
create_bd_cell -type ip -vlnv xilinx.com:xup:xup_and4:1.0 xup_and4_1
set_property -dict {CONFIG.DELAY 0} [get_bd_cells xup_and4_1]
create_bd_cell -type ip -vlnv xilinx.com:xup:xup_and4:1.0 xup_and4_2
set_property -dict {CONFIG.DELAY 0} [get_bd_cells xup_and4_2]
create_bd_cell -type ip -vlnv xilinx.com:xup:xup_and3:1.0 xup_and3_0
set_property -dict {CONFIG.DELAY 0} [get_bd_cells xup_and3_0]
create_bd_cell -type ip -vlnv xilinx.com:xup:xup_inv:1.0 xup_inv_0
set_property -dict {CONFIG.DELAY 0} [get_bd_cells xup_inv_0]
create_bd_cell -type ip -vlnv xilinx.com:xup:xup_inv:1.0 xup_inv_3
set_property -dict {CONFIG.DELAY 0} [get_bd_cells xup_inv_3]
create_bd_cell -type ip -vlnv xilinx.com:xup:xup_inv:1.0 xup_inv_4
set_property -dict {CONFIG.DELAY 0} [get_bd_cells xup_inv_4]
create_bd_cell -type ip -vlnv xilinx.com:xup:xup_inv:1.0 xup_inv_7
set_property -dict {CONFIG.DELAY 0} [get_bd_cells xup_inv_7]
create_bd_cell -type ip -vlnv xilinx.com:xup:xup_inv:1.0 xup_inv_8
set_property -dict {CONFIG.DELAY 0} [get_bd_cells xup_inv_8]
create_bd_cell -type ip -vlnv xilinx.com:xup:xup_inv:1.0 xup_inv_11
set_property -dict {CONFIG.DELAY 0} [get_bd_cells xup_inv_11]

# ---- hierarchy /Regular_Credit/TRIPLE/TRIPLE_7 ----
current_bd_instance /Regular_Credit/TRIPLE/TRIPLE_7
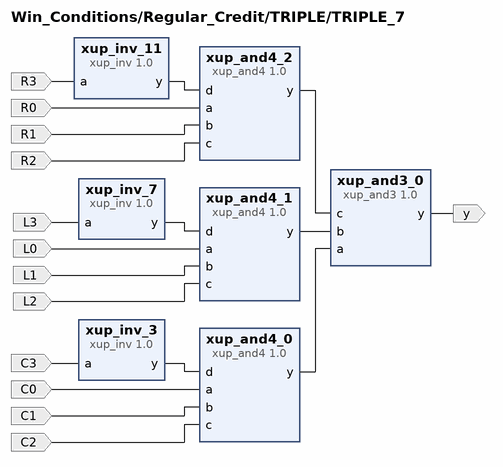
[diagram p15: block diagram inside /Regular_Credit/TRIPLE/TRIPLE_7]
create_bd_pin -dir I C0
create_bd_pin -dir I C1
create_bd_pin -dir I C2
create_bd_pin -dir I C3
create_bd_pin -dir I L0
create_bd_pin -dir I L1
create_bd_pin -dir I L2
create_bd_pin -dir I L3
create_bd_pin -dir I R0
create_bd_pin -dir I R1
create_bd_pin -dir I R2
create_bd_pin -dir I R3
create_bd_pin -dir O y

create_bd_cell -type ip -vlnv xilinx.com:xup:xup_and4:1.0 xup_and4_0
set_property -dict {CONFIG.DELAY 0} [get_bd_cells xup_and4_0]
create_bd_cell -type ip -vlnv xilinx.com:xup:xup_and4:1.0 xup_and4_1
set_property -dict {CONFIG.DELAY 0} [get_bd_cells xup_and4_1]
create_bd_cell -type ip -vlnv xilinx.com:xup:xup_and4:1.0 xup_and4_2
set_property -dict {CONFIG.DELAY 0} [get_bd_cells xup_and4_2]
create_bd_cell -type ip -vlnv xilinx.com:xup:xup_and3:1.0 xup_and3_0
set_property -dict {CONFIG.DELAY 0} [get_bd_cells xup_and3_0]
create_bd_cell -type ip -vlnv xilinx.com:xup:xup_inv:1.0 xup_inv_3
set_property -dict {CONFIG.DELAY 0} [get_bd_cells xup_inv_3]
create_bd_cell -type ip -vlnv xilinx.com:xup:xup_inv:1.0 xup_inv_7
set_property -dict {CONFIG.DELAY 0} [get_bd_cells xup_inv_7]
create_bd_cell -type ip -vlnv xilinx.com:xup:xup_inv:1.0 xup_inv_11
set_property -dict {CONFIG.DELAY 0} [get_bd_cells xup_inv_11]

# ---- hierarchy /Regular_Credit/TRIPLE/TRIPLE_8 ----
current_bd_instance /Regular_Credit/TRIPLE/TRIPLE_8
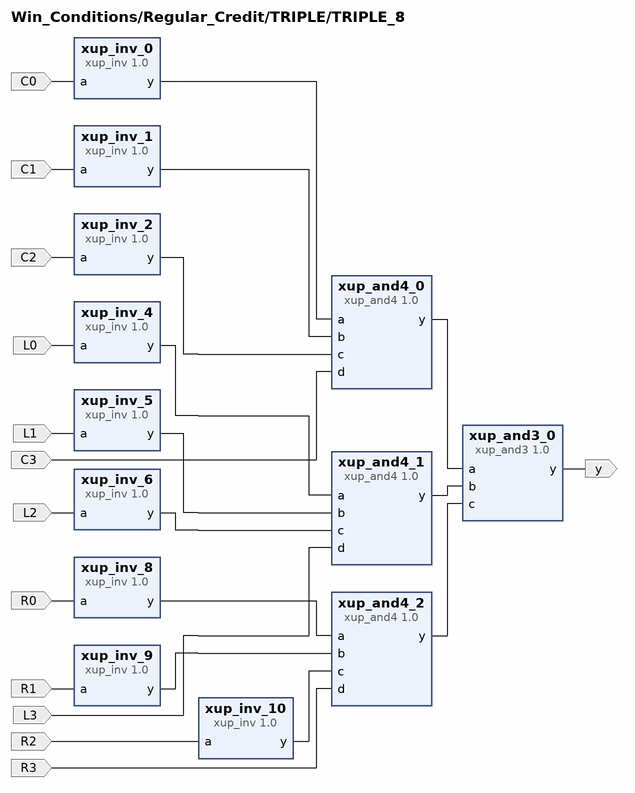
[diagram p16: block diagram inside /Regular_Credit/TRIPLE/TRIPLE_8]
create_bd_pin -dir I C0
create_bd_pin -dir I C1
create_bd_pin -dir I C2
create_bd_pin -dir I C3
create_bd_pin -dir I L0
create_bd_pin -dir I L1
create_bd_pin -dir I L2
create_bd_pin -dir I L3
create_bd_pin -dir I R0
create_bd_pin -dir I R1
create_bd_pin -dir I R2
create_bd_pin -dir I R3
create_bd_pin -dir O y

create_bd_cell -type ip -vlnv xilinx.com:xup:xup_and4:1.0 xup_and4_0
set_property -dict {CONFIG.DELAY 0} [get_bd_cells xup_and4_0]
create_bd_cell -type ip -vlnv xilinx.com:xup:xup_and4:1.0 xup_and4_1
set_property -dict {CONFIG.DELAY 0} [get_bd_cells xup_and4_1]
create_bd_cell -type ip -vlnv xilinx.com:xup:xup_and4:1.0 xup_and4_2
set_property -dict {CONFIG.DELAY 0} [get_bd_cells xup_and4_2]
create_bd_cell -type ip -vlnv xilinx.com:xup:xup_and3:1.0 xup_and3_0
set_property -dict {CONFIG.DELAY 0} [get_bd_cells xup_and3_0]
create_bd_cell -type ip -vlnv xilinx.com:xup:xup_inv:1.0 xup_inv_10
set_property -dict {CONFIG.DELAY 0} [get_bd_cells xup_inv_10]
create_bd_cell -type ip -vlnv xilinx.com:xup:xup_inv:1.0 xup_inv_8
set_property -dict {CONFIG.DELAY 0} [get_bd_cells xup_inv_8]
create_bd_cell -type ip -vlnv xilinx.com:xup:xup_inv:1.0 xup_inv_6
set_property -dict {CONFIG.DELAY 0} [get_bd_cells xup_inv_6]
create_bd_cell -type ip -vlnv xilinx.com:xup:xup_inv:1.0 xup_inv_5
set_property -dict {CONFIG.DELAY 0} [get_bd_cells xup_inv_5]
create_bd_cell -type ip -vlnv xilinx.com:xup:xup_inv:1.0 xup_inv_4
set_property -dict {CONFIG.DELAY 0} [get_bd_cells xup_inv_4]
create_bd_cell -type ip -vlnv xilinx.com:xup:xup_inv:1.0 xup_inv_2
set_property -dict {CONFIG.DELAY 0} [get_bd_cells xup_inv_2]
create_bd_cell -type ip -vlnv xilinx.com:xup:xup_inv:1.0 xup_inv_1
set_property -dict {CONFIG.DELAY 0} [get_bd_cells xup_inv_1]
create_bd_cell -type ip -vlnv xilinx.com:xup:xup_inv:1.0 xup_inv_0
set_property -dict {CONFIG.DELAY 0} [get_bd_cells xup_inv_0]
create_bd_cell -type ip -vlnv xilinx.com:xup:xup_inv:1.0 xup_inv_9
set_property -dict {CONFIG.DELAY 0} [get_bd_cells xup_inv_9]

# ---- hierarchy /Regular_Credit/TRIPLE/TRIPLE_0 ----
current_bd_instance /Regular_Credit/TRIPLE/TRIPLE_0
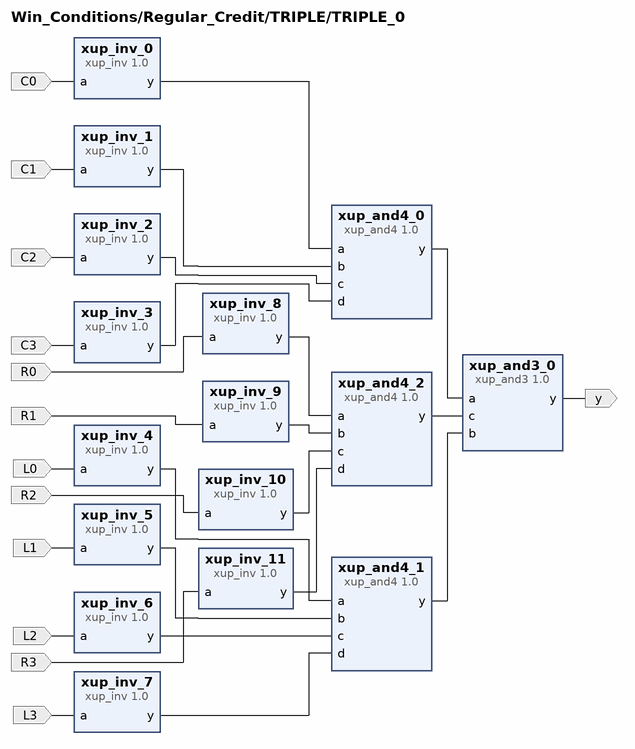
[diagram p17: block diagram inside /Regular_Credit/TRIPLE/TRIPLE_0]
create_bd_pin -dir I C0
create_bd_pin -dir I C1
create_bd_pin -dir I C2
create_bd_pin -dir I C3
create_bd_pin -dir I L0
create_bd_pin -dir I L1
create_bd_pin -dir I L2
create_bd_pin -dir I L3
create_bd_pin -dir I R0
create_bd_pin -dir I R1
create_bd_pin -dir I R2
create_bd_pin -dir I R3
create_bd_pin -dir O y

create_bd_cell -type ip -vlnv xilinx.com:xup:xup_and4:1.0 xup_and4_0
set_property -dict {CONFIG.DELAY 0} [get_bd_cells xup_and4_0]
create_bd_cell -type ip -vlnv xilinx.com:xup:xup_and4:1.0 xup_and4_1
set_property -dict {CONFIG.DELAY 0} [get_bd_cells xup_and4_1]
create_bd_cell -type ip -vlnv xilinx.com:xup:xup_and4:1.0 xup_and4_2
set_property -dict {CONFIG.DELAY 0} [get_bd_cells xup_and4_2]
create_bd_cell -type ip -vlnv xilinx.com:xup:xup_and3:1.0 xup_and3_0
set_property -dict {CONFIG.DELAY 0} [get_bd_cells xup_and3_0]
create_bd_cell -type ip -vlnv xilinx.com:xup:xup_inv:1.0 xup_inv_0
set_property -dict {CONFIG.DELAY 0} [get_bd_cells xup_inv_0]
create_bd_cell -type ip -vlnv xilinx.com:xup:xup_inv:1.0 xup_inv_1
set_property -dict {CONFIG.DELAY 0} [get_bd_cells xup_inv_1]
create_bd_cell -type ip -vlnv xilinx.com:xup:xup_inv:1.0 xup_inv_2
set_property -dict {CONFIG.DELAY 0} [get_bd_cells xup_inv_2]
create_bd_cell -type ip -vlnv xilinx.com:xup:xup_inv:1.0 xup_inv_3
set_property -dict {CONFIG.DELAY 0} [get_bd_cells xup_inv_3]
create_bd_cell -type ip -vlnv xilinx.com:xup:xup_inv:1.0 xup_inv_4
set_property -dict {CONFIG.DELAY 0} [get_bd_cells xup_inv_4]
create_bd_cell -type ip -vlnv xilinx.com:xup:xup_inv:1.0 xup_inv_5
set_property -dict {CONFIG.DELAY 0} [get_bd_cells xup_inv_5]
create_bd_cell -type ip -vlnv xilinx.com:xup:xup_inv:1.0 xup_inv_6
set_property -dict {CONFIG.DELAY 0} [get_bd_cells xup_inv_6]
create_bd_cell -type ip -vlnv xilinx.com:xup:xup_inv:1.0 xup_inv_7
set_property -dict {CONFIG.DELAY 0} [get_bd_cells xup_inv_7]
create_bd_cell -type ip -vlnv xilinx.com:xup:xup_inv:1.0 xup_inv_8
set_property -dict {CONFIG.DELAY 0} [get_bd_cells xup_inv_8]
create_bd_cell -type ip -vlnv xilinx.com:xup:xup_inv:1.0 xup_inv_9
set_property -dict {CONFIG.DELAY 0} [get_bd_cells xup_inv_9]
create_bd_cell -type ip -vlnv xilinx.com:xup:xup_inv:1.0 xup_inv_10
set_property -dict {CONFIG.DELAY 0} [get_bd_cells xup_inv_10]
create_bd_cell -type ip -vlnv xilinx.com:xup:xup_inv:1.0 xup_inv_11
set_property -dict {CONFIG.DELAY 0} [get_bd_cells xup_inv_11]

# ---- hierarchy /Regular_Credit/TRIPLE/TRIPLE_1 ----
current_bd_instance /Regular_Credit/TRIPLE/TRIPLE_1
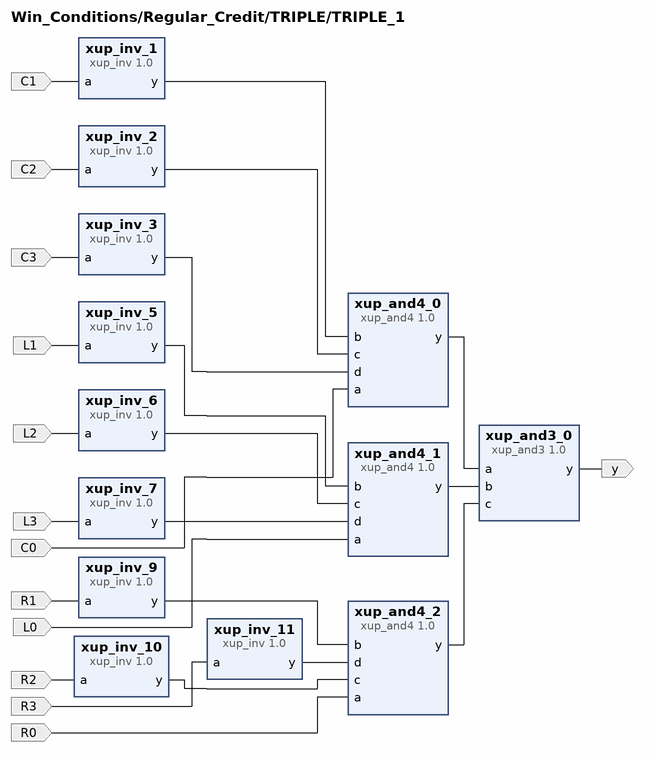
[diagram p18: block diagram inside /Regular_Credit/TRIPLE/TRIPLE_1]
create_bd_pin -dir I C0
create_bd_pin -dir I C1
create_bd_pin -dir I C2
create_bd_pin -dir I C3
create_bd_pin -dir I L0
create_bd_pin -dir I L1
create_bd_pin -dir I L2
create_bd_pin -dir I L3
create_bd_pin -dir I R0
create_bd_pin -dir I R1
create_bd_pin -dir I R2
create_bd_pin -dir I R3
create_bd_pin -dir O y

create_bd_cell -type ip -vlnv xilinx.com:xup:xup_and4:1.0 xup_and4_0
set_property -dict {CONFIG.DELAY 0} [get_bd_cells xup_and4_0]
create_bd_cell -type ip -vlnv xilinx.com:xup:xup_and4:1.0 xup_and4_1
set_property -dict {CONFIG.DELAY 0} [get_bd_cells xup_and4_1]
create_bd_cell -type ip -vlnv xilinx.com:xup:xup_and4:1.0 xup_and4_2
set_property -dict {CONFIG.DELAY 0} [get_bd_cells xup_and4_2]
create_bd_cell -type ip -vlnv xilinx.com:xup:xup_and3:1.0 xup_and3_0
set_property -dict {CONFIG.DELAY 0} [get_bd_cells xup_and3_0]
create_bd_cell -type ip -vlnv xilinx.com:xup:xup_inv:1.0 xup_inv_1
set_property -dict {CONFIG.DELAY 0} [get_bd_cells xup_inv_1]
create_bd_cell -type ip -vlnv xilinx.com:xup:xup_inv:1.0 xup_inv_2
set_property -dict {CONFIG.DELAY 0} [get_bd_cells xup_inv_2]
create_bd_cell -type ip -vlnv xilinx.com:xup:xup_inv:1.0 xup_inv_3
set_property -dict {CONFIG.DELAY 0} [get_bd_cells xup_inv_3]
create_bd_cell -type ip -vlnv xilinx.com:xup:xup_inv:1.0 xup_inv_5
set_property -dict {CONFIG.DELAY 0} [get_bd_cells xup_inv_5]
create_bd_cell -type ip -vlnv xilinx.com:xup:xup_inv:1.0 xup_inv_6
set_property -dict {CONFIG.DELAY 0} [get_bd_cells xup_inv_6]
create_bd_cell -type ip -vlnv xilinx.com:xup:xup_inv:1.0 xup_inv_7
set_property -dict {CONFIG.DELAY 0} [get_bd_cells xup_inv_7]
create_bd_cell -type ip -vlnv xilinx.com:xup:xup_inv:1.0 xup_inv_9
set_property -dict {CONFIG.DELAY 0} [get_bd_cells xup_inv_9]
create_bd_cell -type ip -vlnv xilinx.com:xup:xup_inv:1.0 xup_inv_10
set_property -dict {CONFIG.DELAY 0} [get_bd_cells xup_inv_10]
create_bd_cell -type ip -vlnv xilinx.com:xup:xup_inv:1.0 xup_inv_11
set_property -dict {CONFIG.DELAY 0} [get_bd_cells xup_inv_11]

# ---- hierarchy /Regular_Credit/TRIPLE/TRIPLE_2 ----
current_bd_instance /Regular_Credit/TRIPLE/TRIPLE_2
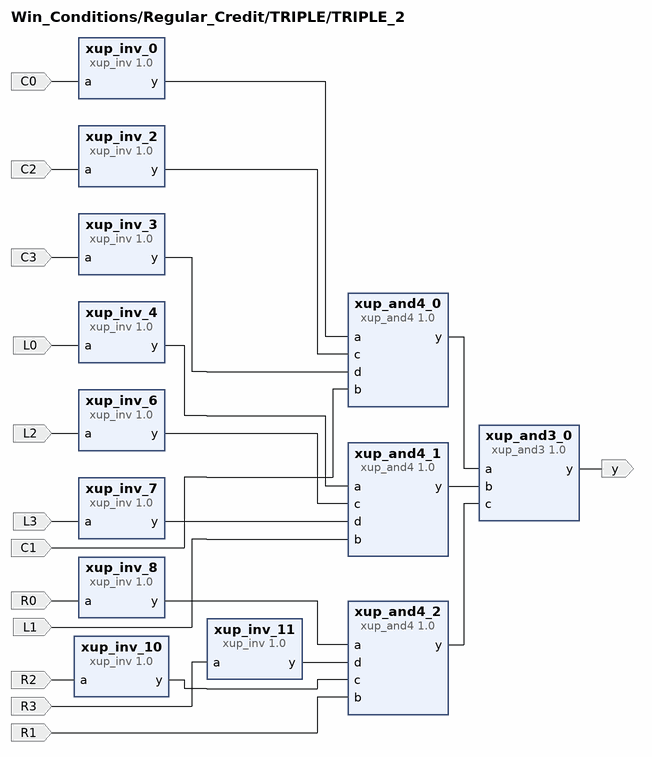
[diagram p19: block diagram inside /Regular_Credit/TRIPLE/TRIPLE_2]
create_bd_pin -dir I C0
create_bd_pin -dir I C1
create_bd_pin -dir I C2
create_bd_pin -dir I C3
create_bd_pin -dir I L0
create_bd_pin -dir I L1
create_bd_pin -dir I L2
create_bd_pin -dir I L3
create_bd_pin -dir I R0
create_bd_pin -dir I R1
create_bd_pin -dir I R2
create_bd_pin -dir I R3
create_bd_pin -dir O y

create_bd_cell -type ip -vlnv xilinx.com:xup:xup_and4:1.0 xup_and4_0
set_property -dict {CONFIG.DELAY 0} [get_bd_cells xup_and4_0]
create_bd_cell -type ip -vlnv xilinx.com:xup:xup_and4:1.0 xup_and4_1
set_property -dict {CONFIG.DELAY 0} [get_bd_cells xup_and4_1]
create_bd_cell -type ip -vlnv xilinx.com:xup:xup_and4:1.0 xup_and4_2
set_property -dict {CONFIG.DELAY 0} [get_bd_cells xup_and4_2]
create_bd_cell -type ip -vlnv xilinx.com:xup:xup_and3:1.0 xup_and3_0
set_property -dict {CONFIG.DELAY 0} [get_bd_cells xup_and3_0]
create_bd_cell -type ip -vlnv xilinx.com:xup:xup_inv:1.0 xup_inv_0
set_property -dict {CONFIG.DELAY 0} [get_bd_cells xup_inv_0]
create_bd_cell -type ip -vlnv xilinx.com:xup:xup_inv:1.0 xup_inv_2
set_property -dict {CONFIG.DELAY 0} [get_bd_cells xup_inv_2]
create_bd_cell -type ip -vlnv xilinx.com:xup:xup_inv:1.0 xup_inv_3
set_property -dict {CONFIG.DELAY 0} [get_bd_cells xup_inv_3]
create_bd_cell -type ip -vlnv xilinx.com:xup:xup_inv:1.0 xup_inv_4
set_property -dict {CONFIG.DELAY 0} [get_bd_cells xup_inv_4]
create_bd_cell -type ip -vlnv xilinx.com:xup:xup_inv:1.0 xup_inv_6
set_property -dict {CONFIG.DELAY 0} [get_bd_cells xup_inv_6]
create_bd_cell -type ip -vlnv xilinx.com:xup:xup_inv:1.0 xup_inv_7
set_property -dict {CONFIG.DELAY 0} [get_bd_cells xup_inv_7]
create_bd_cell -type ip -vlnv xilinx.com:xup:xup_inv:1.0 xup_inv_8
set_property -dict {CONFIG.DELAY 0} [get_bd_cells xup_inv_8]
create_bd_cell -type ip -vlnv xilinx.com:xup:xup_inv:1.0 xup_inv_10
set_property -dict {CONFIG.DELAY 0} [get_bd_cells xup_inv_10]
create_bd_cell -type ip -vlnv xilinx.com:xup:xup_inv:1.0 xup_inv_11
set_property -dict {CONFIG.DELAY 0} [get_bd_cells xup_inv_11]

# ---- hierarchy /Regular_Credit/TRIPLE/TRIPLE_3 ----
current_bd_instance /Regular_Credit/TRIPLE/TRIPLE_3
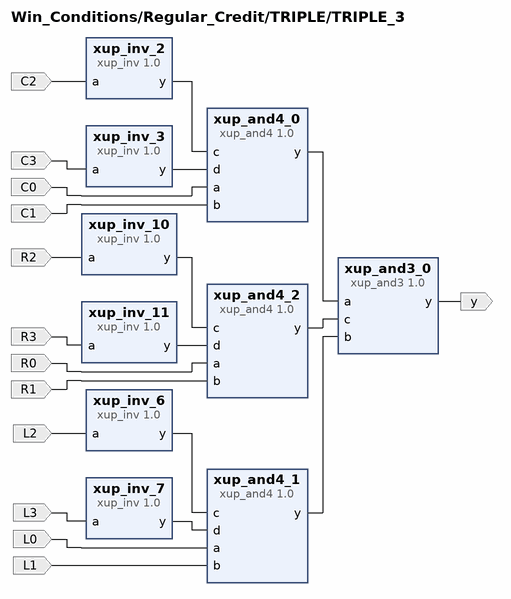
[diagram p20: block diagram inside /Regular_Credit/TRIPLE/TRIPLE_3]
create_bd_pin -dir I C0
create_bd_pin -dir I C1
create_bd_pin -dir I C2
create_bd_pin -dir I C3
create_bd_pin -dir I L0
create_bd_pin -dir I L1
create_bd_pin -dir I L2
create_bd_pin -dir I L3
create_bd_pin -dir I R0
create_bd_pin -dir I R1
create_bd_pin -dir I R2
create_bd_pin -dir I R3
create_bd_pin -dir O y

create_bd_cell -type ip -vlnv xilinx.com:xup:xup_and4:1.0 xup_and4_0
set_property -dict {CONFIG.DELAY 0} [get_bd_cells xup_and4_0]
create_bd_cell -type ip -vlnv xilinx.com:xup:xup_and4:1.0 xup_and4_1
set_property -dict {CONFIG.DELAY 0} [get_bd_cells xup_and4_1]
create_bd_cell -type ip -vlnv xilinx.com:xup:xup_and4:1.0 xup_and4_2
set_property -dict {CONFIG.DELAY 0} [get_bd_cells xup_and4_2]
create_bd_cell -type ip -vlnv xilinx.com:xup:xup_and3:1.0 xup_and3_0
set_property -dict {CONFIG.DELAY 0} [get_bd_cells xup_and3_0]
create_bd_cell -type ip -vlnv xilinx.com:xup:xup_inv:1.0 xup_inv_2
set_property -dict {CONFIG.DELAY 0} [get_bd_cells xup_inv_2]
create_bd_cell -type ip -vlnv xilinx.com:xup:xup_inv:1.0 xup_inv_3
set_property -dict {CONFIG.DELAY 0} [get_bd_cells xup_inv_3]
create_bd_cell -type ip -vlnv xilinx.com:xup:xup_inv:1.0 xup_inv_6
set_property -dict {CONFIG.DELAY 0} [get_bd_cells xup_inv_6]
create_bd_cell -type ip -vlnv xilinx.com:xup:xup_inv:1.0 xup_inv_7
set_property -dict {CONFIG.DELAY 0} [get_bd_cells xup_inv_7]
create_bd_cell -type ip -vlnv xilinx.com:xup:xup_inv:1.0 xup_inv_10
set_property -dict {CONFIG.DELAY 0} [get_bd_cells xup_inv_10]
create_bd_cell -type ip -vlnv xilinx.com:xup:xup_inv:1.0 xup_inv_11
set_property -dict {CONFIG.DELAY 0} [get_bd_cells xup_inv_11]

# ---- hierarchy /Regular_Credit/TRIPLE/TRIPLE_4 ----
current_bd_instance /Regular_Credit/TRIPLE/TRIPLE_4
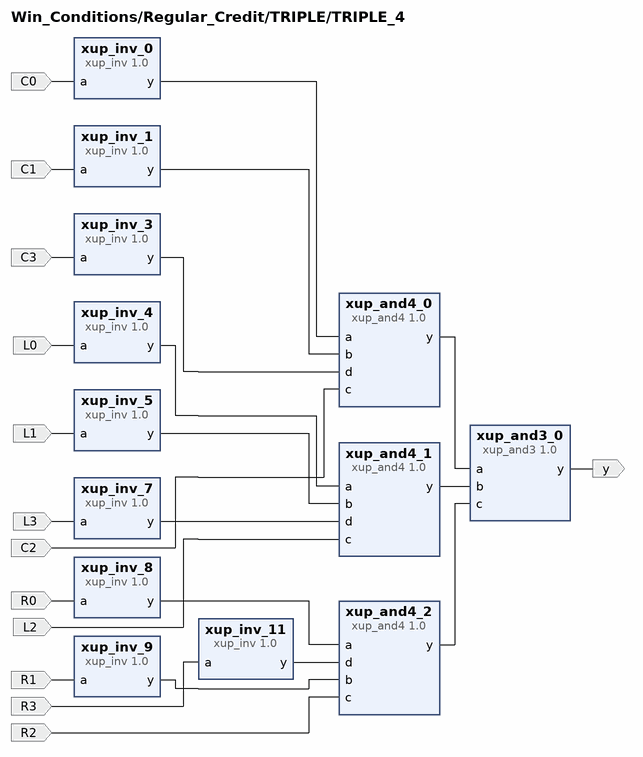
[diagram p21: block diagram inside /Regular_Credit/TRIPLE/TRIPLE_4]
create_bd_pin -dir I C0
create_bd_pin -dir I C1
create_bd_pin -dir I C2
create_bd_pin -dir I C3
create_bd_pin -dir I L0
create_bd_pin -dir I L1
create_bd_pin -dir I L2
create_bd_pin -dir I L3
create_bd_pin -dir I R0
create_bd_pin -dir I R1
create_bd_pin -dir I R2
create_bd_pin -dir I R3
create_bd_pin -dir O y

create_bd_cell -type ip -vlnv xilinx.com:xup:xup_and4:1.0 xup_and4_0
set_property -dict {CONFIG.DELAY 0} [get_bd_cells xup_and4_0]
create_bd_cell -type ip -vlnv xilinx.com:xup:xup_and4:1.0 xup_and4_1
set_property -dict {CONFIG.DELAY 0} [get_bd_cells xup_and4_1]
create_bd_cell -type ip -vlnv xilinx.com:xup:xup_and4:1.0 xup_and4_2
set_property -dict {CONFIG.DELAY 0} [get_bd_cells xup_and4_2]
create_bd_cell -type ip -vlnv xilinx.com:xup:xup_and3:1.0 xup_and3_0
set_property -dict {CONFIG.DELAY 0} [get_bd_cells xup_and3_0]
create_bd_cell -type ip -vlnv xilinx.com:xup:xup_inv:1.0 xup_inv_0
set_property -dict {CONFIG.DELAY 0} [get_bd_cells xup_inv_0]
create_bd_cell -type ip -vlnv xilinx.com:xup:xup_inv:1.0 xup_inv_1
set_property -dict {CONFIG.DELAY 0} [get_bd_cells xup_inv_1]
create_bd_cell -type ip -vlnv xilinx.com:xup:xup_inv:1.0 xup_inv_3
set_property -dict {CONFIG.DELAY 0} [get_bd_cells xup_inv_3]
create_bd_cell -type ip -vlnv xilinx.com:xup:xup_inv:1.0 xup_inv_4
set_property -dict {CONFIG.DELAY 0} [get_bd_cells xup_inv_4]
create_bd_cell -type ip -vlnv xilinx.com:xup:xup_inv:1.0 xup_inv_5
set_property -dict {CONFIG.DELAY 0} [get_bd_cells xup_inv_5]
create_bd_cell -type ip -vlnv xilinx.com:xup:xup_inv:1.0 xup_inv_7
set_property -dict {CONFIG.DELAY 0} [get_bd_cells xup_inv_7]
create_bd_cell -type ip -vlnv xilinx.com:xup:xup_inv:1.0 xup_inv_8
set_property -dict {CONFIG.DELAY 0} [get_bd_cells xup_inv_8]
create_bd_cell -type ip -vlnv xilinx.com:xup:xup_inv:1.0 xup_inv_9
set_property -dict {CONFIG.DELAY 0} [get_bd_cells xup_inv_9]
create_bd_cell -type ip -vlnv xilinx.com:xup:xup_inv:1.0 xup_inv_11
set_property -dict {CONFIG.DELAY 0} [get_bd_cells xup_inv_11]
